# EAGLE schematic hack (EAGLE 4.13)
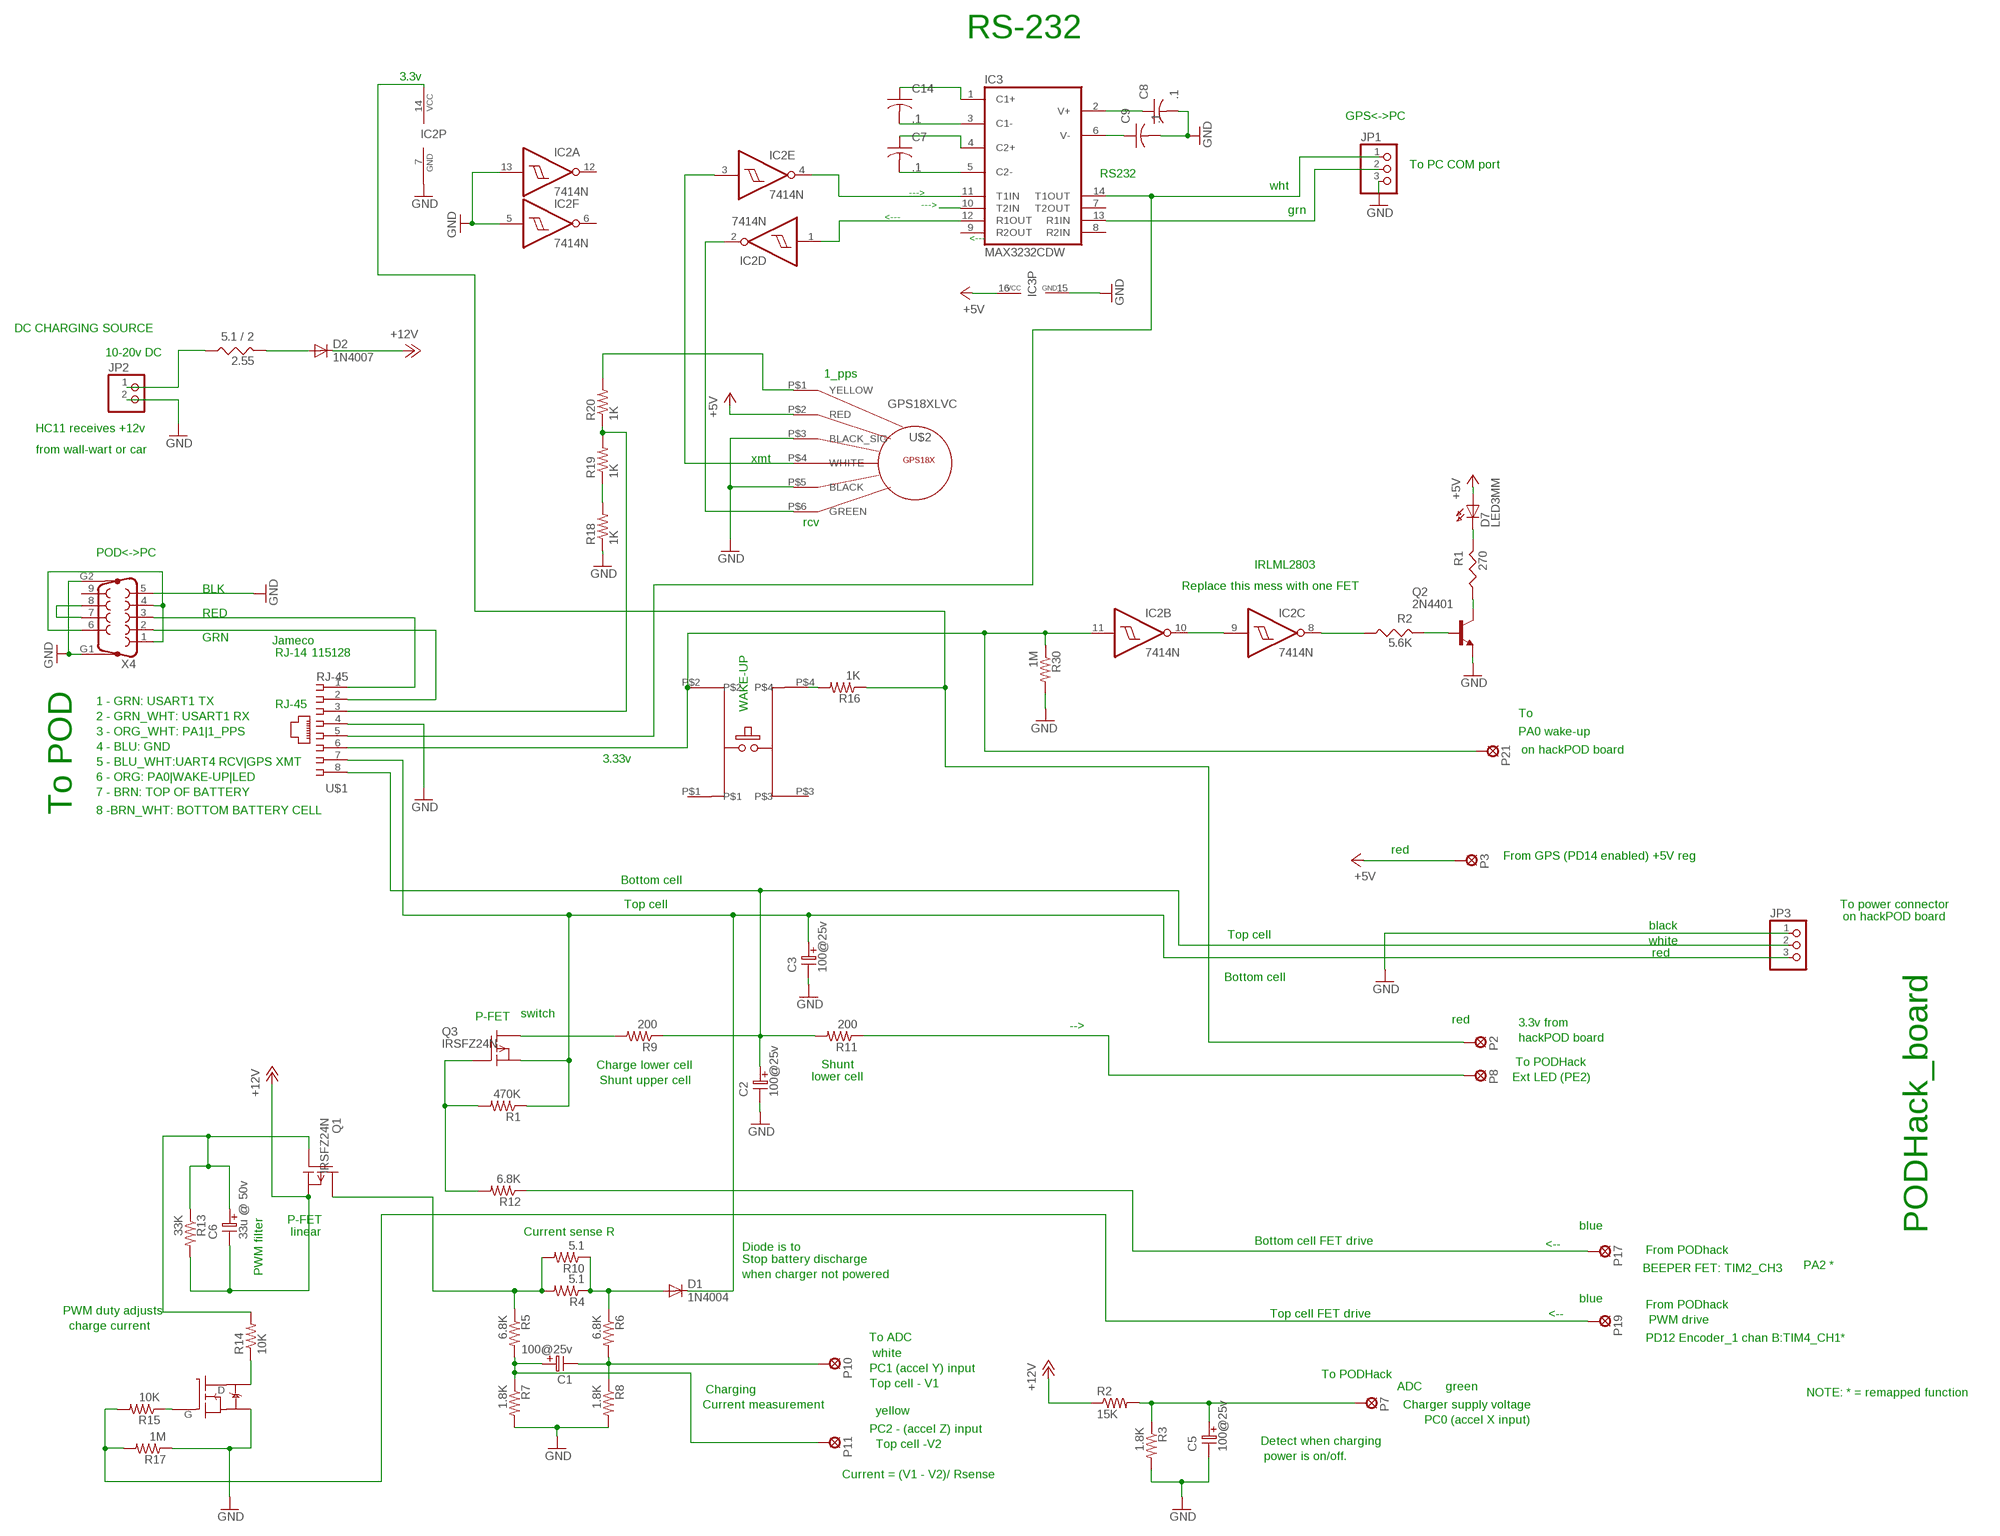
[diagram p0: schematic, sheet 1]

## Parts
2.55  5.1 / 2  RESUS-S2,5  [RS-2,5]
5.6K  R2  RESUS-S2,5  [RS-2,5]
270  R1  RESUS-S2,5  [RS-2,5]
C1  100@25v  ELC-2,5L  [ES-2,5L]
C2  100@25v  ELC-2,5L  [ES-2,5L]
C3  100@25v  ELC-2,5L  [ES-2,5L]
C5  100@25v  ELC-2,5L  [ES-2,5L]
C6  33u @ 50v  ELC-2,5  [ES-2,5]
C7  .1  SMT0805  [SMT0805]
C8  .1  SMT0805  [SMT0805]
C9  .1  SMT0805  [SMT0805]
C14  .1  SMT0805  [SMT0805]
D1  1N4004  [DO41-10]
D2  1N4007  1N4004_VERT  [DO41-10_VERT]
D7  LED3MM  [LED3MM]
IC2  7414N  [DIL14]
IC3  MAX3232CDW  MAX232ECWE  [SO16L]
JP1  PINHD-1X3  [1X03]
JP2  PINHD-1X2  [1X02]
JP3  PINHD-1X3  [1X03]
P2  BEEP  SOLPAD035  [SOLDPAD035]
P3  BEEP  SOLPAD035  [SOLDPAD035]
P7  BEEP  SOLPAD035  [SOLDPAD035]
P8  BEEP  SOLPAD035  [SOLDPAD035]
P10  BEEP  SOLPAD035  [SOLDPAD035]
P11  BEEP  SOLPAD035  [SOLDPAD035]
P17  BEEP  SOLPAD035  [SOLDPAD035]
P19  BEEP  SOLPAD035  [SOLDPAD035]
P21  BEEP  SOLPAD035  [SOLDPAD035]
Q1  IRSFZ24N  BUZ171  [TO220]
Q2  2N4401  2N4416  [TO92]
Q3  IRSFZ24N  BUZ171  [TO220]
Q5  IRLML2060  [SOT-23]
R1  470K  R-US_M0805  [M0805]
R2  15K  R-US_M0805  [M0805]
R3  1.8K  R-US_M0805  [M0805]
R4  5.1  R-US_M0805  [M0805]
R5  6.8K  R-US_M0805  [M0805]
R6  6.8K  R-US_M0805  [M0805]
R7  1.8K  R-US_M0805  [M0805]
R8  1.8K  R-US_M0805  [M0805]
R9  200  R-US_M0805  [M0805]
R10  5.1  R-US_M0805  [M0805]
R11  200  R-US_M0805  [M0805]
R12  6.8K  R-US_M0805  [M0805]
R13  33K  R-US_M0805  [M0805]
R14  10K  R-US_M0805  [M0805]
R15  10K  R-US_M0805  [M0805]
R16  1K  R-US_R0603  [R0603]
R17  1M  R-US_M0805  [M0805]
R18  1K  R-US_R0603  [R0603]
R19  1K  R-US_R0603  [R0603]
R20  1K  R-US_R0603  [R0603]
R30  1M  R-US_M0805  [M0805]
SW100  E-SWITCH  [E-SWITCH]
U$1  RJ-45  8P8CJACK  [8P8C]
U$2  GPS18XLVC  [GPS18XLVC]
X4  F09VP  [F09VP]

## Nets
1K_DIVIDER_WAKE-UP_HI-SIDE: R16.2 SW100.P$4
2N4401_BASE: 5.6K.2 Q2.2(B)
2N4402_COLLECTOR: 270.1 Q2.1(C)
232_T2IN: IC3.10(T2IN)
+5V: D7.A IC3.16(VCC) P3.MP U$2.P$2(RED)
+12V: C6.2 D2.C Q1.3(S) R2.1 R13.2
C2+: C7.P$1 IC3.4(C2+)
C2-: C7.P$2 IC3.5(C2-)
C!+: C14.P$1 IC3.1(C1+)
C!-: C14.P$2 IC3.3(C1-)
GND: C2.2 C3.2 C5.2 C8.P$2 C9.P$2 IC2.5(F:I) IC2.7(P:GND) IC2.13(A:I) IC3.15(GND) JP1.3 JP2.2 JP3.1 Q2.3(E) Q5.2(S) R3.2 R7.2 R8.2 R17.1 R18.1 R30.2 U$1.4 U$2.P$3(BLACK_SIG) U$2.P$5(BLACK) X4.5 X4.G1 X4.G2
GPS_1_PPS_5V: R20.2 U$2.P$1(YELLOW)
GPS_RCV: IC2.2(D:O) U$2.P$6(GREEN)
GPS_XMT: IC2.3(E:I) U$2.P$4(WHITE)
LED_2N4401_SIDE: 270.2 D7.K(C)
LED_INVERTER-INVERTER: IC2.9(C:I) IC2.10(B:O)
LED_INVERTER_OUTPUT: 5.6K.1 IC2.8(C:O)
MORE_RS232_STUFF: X4.7 X4.8
N$1: Q3.2(D) R9.2
N$2: P8.MP R11.1
N$3: Q5.1(G) R15.1
N$4: Q5.3(D) R14.1
N$5: C5.1 P7.MP R2.2 R3.1
N$6: Q3.1(G) R1.2 R12.2
N$8: C1.1 P11.MP R5.2 R7.1
N$9: C1.2 P10.MP R6.2 R8.1
N$10: Q1.2(D) R4.2 R5.1 R10.2
N$11: D1.A R4.1 R6.1 R10.1
N$13: C3.1 D1.C JP3.3 Q3.3(S) R1.1 U$1.7
N$14: 2.55.2 D2.A
N$15: P17.MP R12.1
N$16: P19.MP R15.2 R17.2
N$17: IC3.13(R1IN) JP1.2
N$18: R18.2 R19.1
N$19: IC2.14(P:VCC) P2.MP R16.1
N$21: 2.55.1 JP2.1
N$22: C2.1 JP3.2 R9.1 R11.2 U$1.8
N$23: C6.1 Q1.1(G) R13.1 R14.2
PA1|GPS_1_PPS_3.3V: R19.2 R20.1 U$1.3
PA1|RJ-45_SPARE: IC2.11(B:I) P21.MP R30.1 SW100.P$2 U$1.6
RS232_R1IN_USART1_RX: U$1.1 X4.3
RS-232_STUFF: X4.1 X4.4 X4.6
T1OUT_USART1_TX: U$1.2 X4.2
TTY_S0_RX: IC2.1(D:I) IC3.12(R1OUT)
TTY_S0_TX: IC2.4(E:O) IC3.11(T1IN)
UART4_RCV|GPS_XMIT: IC3.14(T1OUT) JP1.1 U$1.5
V+: C8.P$1 IC3.2(V+)
V-: C9.P$1 IC3.6(V-)
Unconnected: IC2.6(F:O) IC2.12(A:O) IC3.7(T2OUT) IC3.8(R2IN) IC3.9(R2OUT) SW100.P$1 SW100.P$3 X4.9

## Notes on the sheet
- RS-232
- 3.3v
- GPS<->PC
- To PC COM port
- RS232
- wht
- --->
- --->
- grn
- <---
- <---
- DC CHARGING SOURCE
- 10-20v DC
- 1_pps
- HC11 receives +12v
- from wall-wart or car
- xmt
- rcv
- POD<->PC
- IRLML2803
- BLK | Replace this mess with one FET
- RED
- GRN | Jameco
- RJ-14 | 115128
- 1 - GRN: USART1 TX | RJ-45
- WAKE-UP
- 2 - GRN_WHT: USART1 RX | To
- 3 - ORG_WHT: PA1|1_PPS | PA0 wake-up
- 4 - BLU: GND | on hackPOD board
- 5 - BLU_WHT:UART4 RCV|GPS XMT | 3.33v
- 6 - ORG: PA0|WAKE-UP|LED
- 7 - BRN: TOP OF BATTERY
- To POD | 8 -BRN_WHT: BOTTOM BATTERY CELL
- red
- From GPS (PD14 enabled) +5V reg
- Bottom cell
- Top cell | To power connector
- on hackPOD board
- black
- Top cell
- white
- red
- Bottom cell
- P-FET | switch
- red | 3.3v from
- -->
- hackPOD board
- Shunt
- Charge lower cell | To PODHack
- lower cell
- Shunt upper cell | Ext LED (PE2)
- P-FET
- blue | PODHack_board
- linear | Current sense R
- Bottom cell FET drive | <--
- Diode is to | From PODhack
- Stop battery discharge
- BEEPER FET: TIM2_CH3 | PA2 *
- PWM filter | when charger not powered
- blue
- From PODhack
- PWM duty adjusts | Top cell FET drive | <--
- PWM drive
- charge current | To ADC
- PD12 Encoder_1 chan B:TIM4_CH1*
- white
- PC1 (accel Y) input
- To PODHack
- Top cell - V1 | ADC | green
- Charging | NOTE: * = remapped function
- Current measurement | Charger supply voltage
- yellow
- PC0 (accel X input)
- PC2 - (accel Z) input
- Top cell -V2 | Detect when charging
- power is on/off.
- Current = (V1 - V2)/ Rsense

## Library data of the parts
2.55 5.6K 270 = DEH:RESUS-S2,5
C1-C3 C5 = DEH:ELC-2,5L
C6 = DEH:ELC-2,5
C7-C9 C14 = DEH:SMT0805
D1 = diode:1N4004: DIODE general purpose rectifier, 1 A
D2 = diode:1N4004_VERT
D7 = led:LED3MM: LED 3 mm, round
IC2 = 74xx-us:74*14: Hex schmitt trigger INVERTER
IC3 = maxim:MAX232ECWE: RS232 TRANSEIVER
JP1 JP3 = pinhead:PINHD-1X3: PIN HEADER
JP2 = pinhead:PINHD-1X2: PIN HEADER
P2 P3 P7 P8 P10 P11 P17 P19 P21 = solpad:SOLPAD035
Q1 Q3 = transistor-fet:BUZ171: P-Channel Enhancement MOSFET -50V; 7A; 0,4Ohm
Q2 = transistor-npn:2N4416: NPN Transistor
Q5 = transistor-fet:IRLML2060
R1-R20 R30 = rcl:R-US_: RESISTOR, American symbol
SW100 = switch-misc:E-SWITCH
U$1 = con-amp:8P8CJACK
U$2 = DEH:GPS18XLVC
X4 = con-subd:F09VP: SUB-D